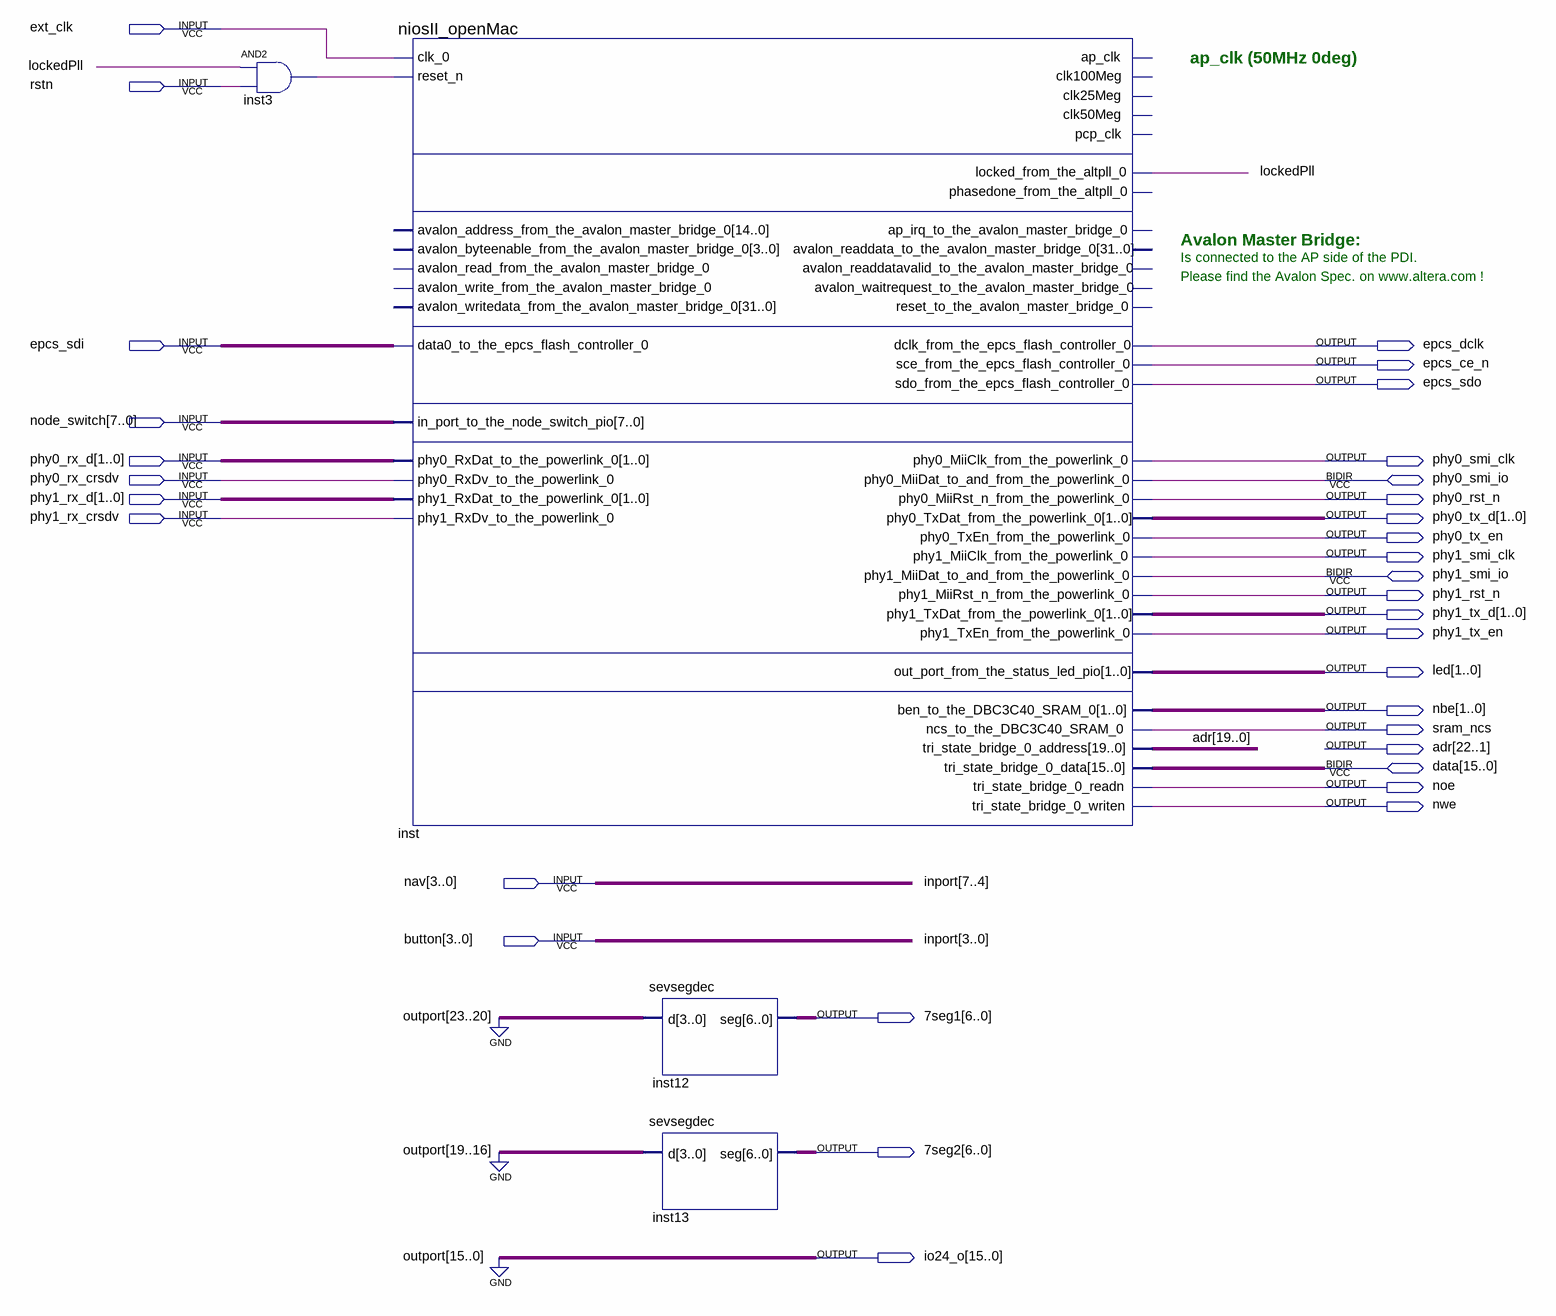
[diagram p0: schematic sheet]
// Quartus schematic nios_pll.bdf as structural Verilog: 4 symbols, 33 pins
module nios_pll (
  input  ext_clk,
  input  rstn,
  input  epcs_sdi,
  input  [7:0] node_switch,
  input  [1:0] phy0_rx_d,
  input  phy0_rx_crsdv,
  input  [1:0] phy1_rx_d,
  input  phy1_rx_crsdv,
  input  [3:0] nav,
  input  [3:0] button,
  inout  phy0_smi_io,
  inout  phy1_smi_io,
  inout  [15:0] data,
  output epcs_dclk,
  output epcs_ce_n,
  output epcs_sdo,
  output phy0_smi_clk,
  output phy0_rst_n,
  output [1:0] phy0_tx_d,
  output phy0_tx_en,
  output phy1_smi_clk,
  output phy1_rst_n,
  output [1:0] phy1_tx_d,
  output phy1_tx_en,
  output [1:0] led,
  output [1:0] nbe,
  output sram_ncs,
  output [22:0] adr,
  output noe,
  output nwe,
  output [6:0] \7seg1 ,
  output [6:0] \7seg2 ,
  output [15:0] io24_o
);

  wire inst3_out, lockedPll;

  and inst3 (inst3_out, lockedPll, rstn);
  niosII_openMac inst (
    .clk_0(ext_clk), .reset_n(inst3_out), .data0_to_the_epcs_flash_controller_0(epcs_sdi),
    .in_port_to_the_node_switch_pio(node_switch), .phy0_RxDat_to_the_powerlink_0(phy0_rx_d),
    .phy0_RxDv_to_the_powerlink_0(phy0_rx_crsdv), .phy1_RxDat_to_the_powerlink_0(phy1_rx_d),
    .phy1_RxDv_to_the_powerlink_0(phy1_rx_crsdv), .locked_from_the_altpll_0(lockedPll),
    .dclk_from_the_epcs_flash_controller_0(epcs_dclk), .sce_from_the_epcs_flash_controller_0(epcs_ce_n),
    .sdo_from_the_epcs_flash_controller_0(epcs_sdo), .phy0_MiiClk_from_the_powerlink_0(phy0_smi_clk),
    .phy0_MiiRst_n_from_the_powerlink_0(phy0_rst_n), .phy0_TxDat_from_the_powerlink_0(phy0_tx_d),
    .phy0_TxEn_from_the_powerlink_0(phy0_tx_en), .phy1_MiiClk_from_the_powerlink_0(phy1_smi_clk),
    .phy1_MiiRst_n_from_the_powerlink_0(phy1_rst_n), .phy1_TxDat_from_the_powerlink_0(phy1_tx_d),
    .phy1_TxEn_from_the_powerlink_0(phy1_tx_en), .out_port_from_the_status_led_pio(led),
    .ben_to_the_DBC3C40_SRAM_0(nbe), .ncs_to_the_DBC3C40_SRAM_0(sram_ncs),
    .tri_state_bridge_0_address(adr[19:0]), .tri_state_bridge_0_readn(noe), .tri_state_bridge_0_writen(nwe),
    .phy0_MiiDat_to_and_from_the_powerlink_0(phy0_smi_io),
    .phy1_MiiDat_to_and_from_the_powerlink_0(phy1_smi_io), .tri_state_bridge_0_data(data));  // open: avalon_address_from_the_avalon_master_bridge_0, avalon_byteenable_from_the_avalon_master_bridge_0, avalon_read_from_the_avalon_master_bridge_0, avalon_write_from_the_avalon_master_bridge_0, avalon_writedata_from_the_avalon_master_bridge_0, ap_clk, clk100Meg, clk25Meg, clk50Meg, pcp_clk, phasedone_from_the_altpll_0, ap_irq_to_the_avalon_master_bridge_0, avalon_readdata_to_the_avalon_master_bridge_0, avalon_readdatavalid_to_the_avalon_master_bridge_0, avalon_waitrequest_to_the_avalon_master_bridge_0, reset_to_the_avalon_master_bridge_0
  sevsegdec inst12 (.d(4'b0000), .seg(\7seg1 ));
  sevsegdec inst13 (.d(4'b0000), .seg(\7seg2 ));

  assign io24_o = {16{1'b0}};

  // Other names for the same wires on the sheet: inport[7:0] = {nav, button}

  // Notes on the sheet:
  //   ap_clk (50MHz 0deg)
  //   Avalon Master Bridge:
  //   Is connected to the AP side of the PDI.
  //   Please find the Avalon Spec. on www.altera.com !
endmodule
